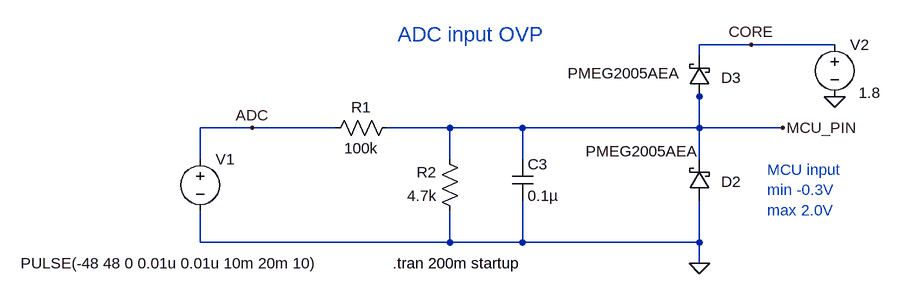
[diagram p0: schematic ADC_Input_OVP.asc]
ADC_Input_OVP.asc, the LTspice schematic file:
Version 4
SHEET 1 1596 1916
WIRE 464 0 384 0
WIRE 592 0 464 0
WIRE 384 16 384 0
WIRE 384 80 384 64
WIRE -304 128 -384 128
WIRE -176 128 -304 128
WIRE 0 128 -96 128
WIRE 112 128 0 128
WIRE 384 128 384 80
WIRE 384 128 112 128
WIRE 512 128 384 128
WIRE -384 176 -384 128
WIRE 0 176 0 128
WIRE 112 176 112 128
WIRE 384 176 384 128
WIRE -384 304 -384 256
WIRE 0 304 0 256
WIRE 0 304 -384 304
WIRE 112 304 112 240
WIRE 112 304 0 304
WIRE 384 304 384 240
WIRE 384 304 112 304
WIRE 384 336 384 304
FLAG 384 336 0
FLAG -304 128 ADC
FLAG 512 128 MCU_PIN
FLAG 464 0 CORE
FLAG 592 80 0
SYMBOL cap 96 176 R0
SYMATTR InstName C3
SYMATTR Value 0.1µ
SYMBOL res -80 112 R90
WINDOW 0 0 56 VBottom 2
WINDOW 3 32 56 VTop 2
SYMATTR InstName R1
SYMATTR Value 100k
SYMBOL voltage -384 160 R0
WINDOW 3 -276 176 Left 2
WINDOW 123 0 0 Left 0
WINDOW 39 0 0 Left 0
SYMATTR Value PULSE(-48 48 0 0.01u 0.01u 10m 20m 10)
SYMATTR InstName V1
SYMBOL schottky 400 80 R180
WINDOW 0 -48 29 Left 2
WINDOW 3 47 36 Left 2
SYMATTR InstName D3
SYMATTR Value PMEG2005AEA
SYMATTR Description Diode
SYMATTR Type diode
SYMBOL voltage 592 -16 R0
WINDOW 3 37 90 Left 2
WINDOW 123 0 0 Left 0
WINDOW 39 0 0 Left 0
SYMATTR Value 1.8
SYMATTR InstName V2
SYMBOL res 16 272 R180
WINDOW 0 36 76 Left 2
WINDOW 3 36 40 Left 2
SYMATTR InstName R2
SYMATTR Value 4.7k
SYMBOL schottky 400 240 R180
WINDOW 0 -48 29 Left 2
WINDOW 3 19 76 Left 2
SYMATTR InstName D2
SYMATTR Value PMEG2005AEA
SYMATTR Description Diode
SYMATTR Type diode
TEXT -88 336 Left 2 !.tran 200m startup
TEXT -80 -16 Left 3 ;ADC input OVP
TEXT 488 192 Left 2 ;MCU input\nmin -0.3V\nmax 2.0V

The netlist it stands for:
* ADC_Input_OVP.asc
C3 MCU_PIN 0 0.1µ
R1 MCU_PIN ADC 100k
V1 ADC 0 PULSE(-48 48 0 0.01u 0.01u 10m 20m 10)
D3 MCU_PIN CORE PMEG2005AEA
V2 CORE 0 1.8
R2 0 MCU_PIN 4.7k
D2 0 MCU_PIN PMEG2005AEA
.model D D
.lib standard.dio
.tran 200m startup
* ADC input OVP
* MCU input
* min -0.3V
* max 2.0V
.backanno
.end

* Results of the author's LTspice run, read from the files saved beside the schematic
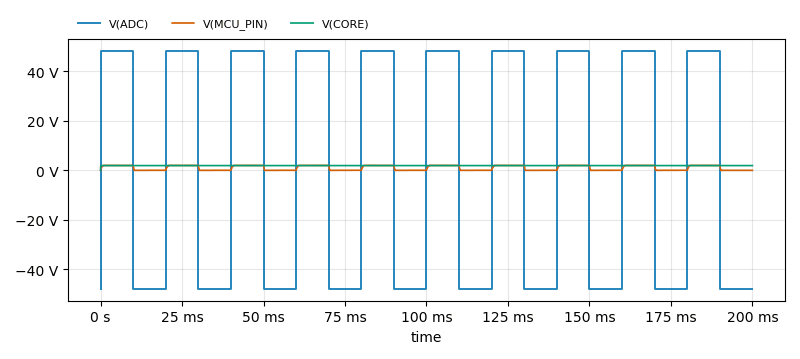
[diagram p1: Transient Analysis of ADC_Input_OVP.asc, plotted from the saved traces]
* Transient Analysis, 1 run:
*   V(ADC): min -48 V, max 48 V, average 48 µV, rms 48 V, last -48 V
*   V(MCU_PIN): min -124.5 mV, max 1.874 V, average 856.5 mV, rms 1.301 V, last -124.4 mV
*   V(CORE): min 0 V, max 1.8 V, average 1.8 V, rms 1.8 V, last 1.8 V